# Altium schematic sheet Jetson_Xavier_NX_Carrier_Board_v1.1.SchDoc
size A3
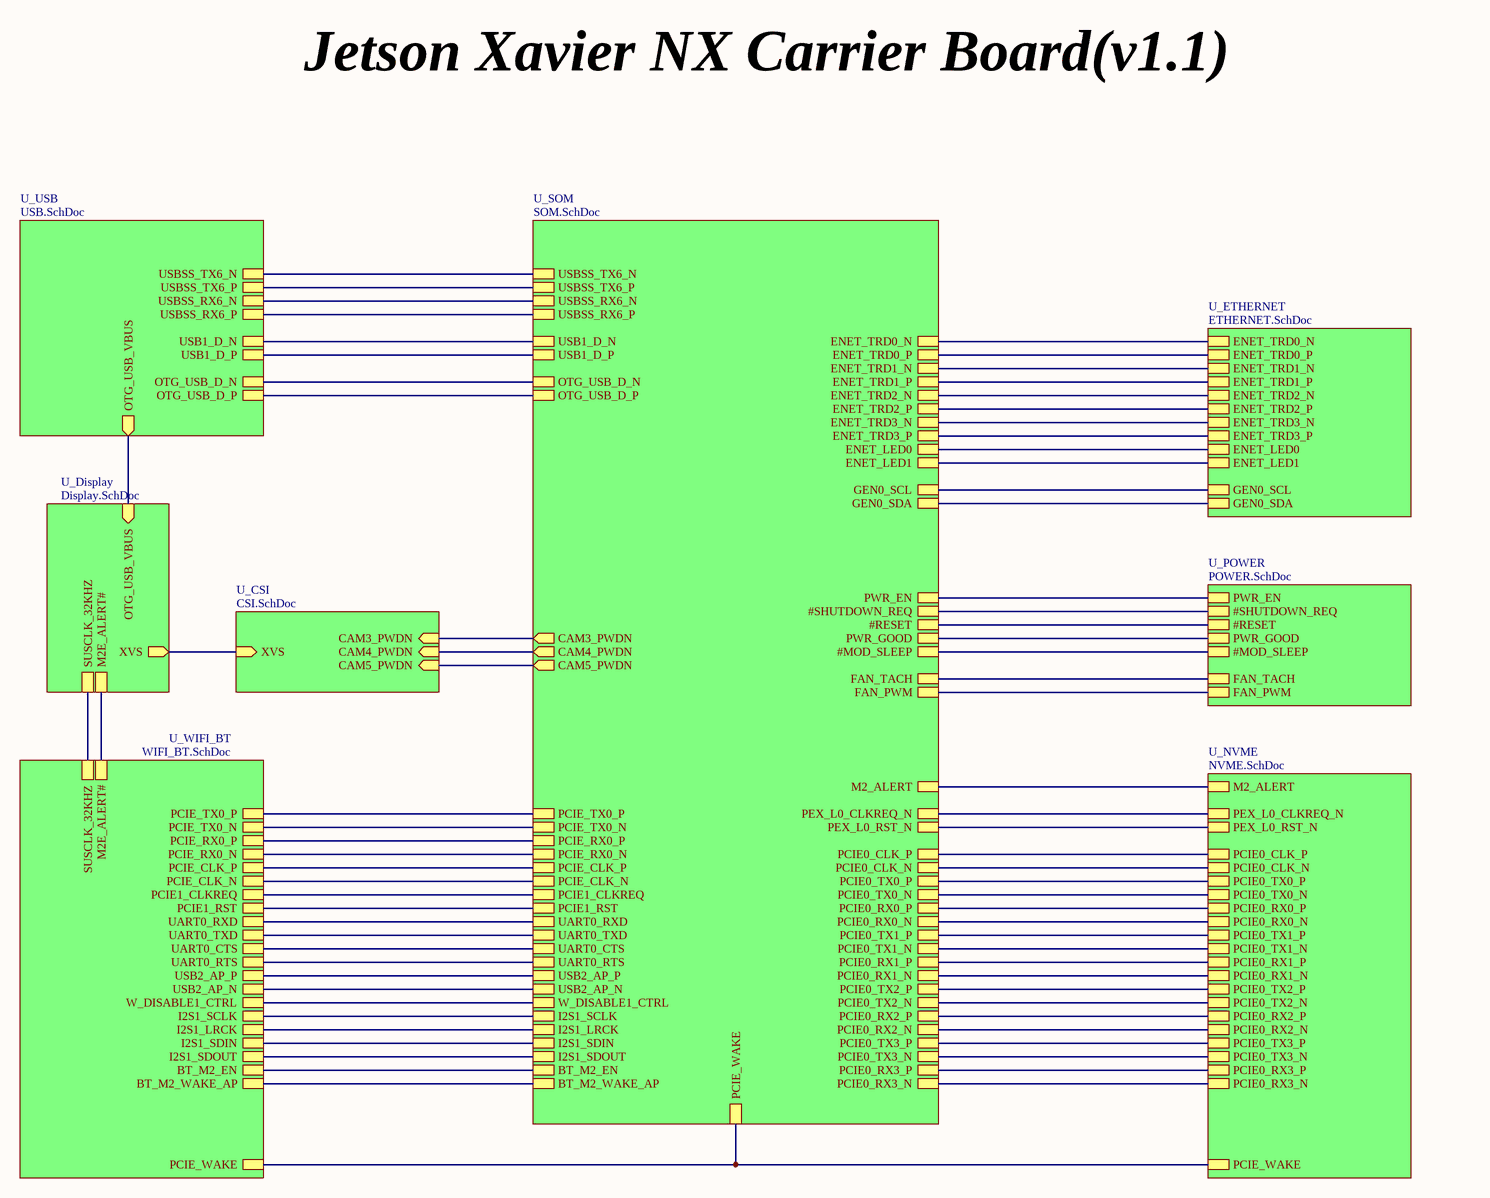
[diagram p0: Jetson_Xavier_NX_Carrier_Board_v1.1.SchDoc]

## Sub-sheets
U_CSI = CSI.SchDoc: XVS (in), CAM3_PWDN (in), CAM4_PWDN (in), CAM5_PWDN (in)
U_Display = Display.SchDoc: OTG_USB_VBUS (in), M2E_ALERT#, SUSCLK_32KHZ, XVS (out)
U_ETHERNET = ETHERNET.SchDoc: ENET_LED1, ENET_TRD0_N, ENET_TRD0_P, ENET_TRD1_N, ENET_TRD1_P, ENET_TRD2_N, ENET_TRD2_P, ENET_TRD3_N, ENET_TRD3_P, ENET_LED0, GEN0_SCL, GEN0_SDA
U_NVME = NVME.SchDoc: PCIE_WAKE, PEX_L0_RST_N, PCIE0_CLK_P, PCIE0_CLK_N, PCIE0_TX0_P, PCIE0_TX0_N, PCIE0_RX0_P, PCIE0_RX0_N, PCIE0_TX1_P, PCIE0_TX1_N, PCIE0_RX1_P, PCIE0_RX1_N, PCIE0_TX2_P, PCIE0_TX2_N, PCIE0_RX2_P, PCIE0_RX2_N, PCIE0_TX3_P, PCIE0_TX3_N, PCIE0_RX3_P, PCIE0_RX3_N, PEX_L0_CLKREQ_N, M2_ALERT
U_POWER = POWER.SchDoc: PWR_EN, #SHUTDOWN_REQ, #RESET, PWR_GOOD, #MOD_SLEEP, FAN_TACH, FAN_PWM
U_SOM = SOM.SchDoc: PWR_EN, #SHUTDOWN_REQ, #RESET, PWR_GOOD, #MOD_SLEEP, GEN0_SCL, GEN0_SDA, PCIE_WAKE, PEX_L0_RST_N, PCIE0_CLK_P, PCIE0_CLK_N, PCIE0_TX0_P, PCIE0_TX0_N, PCIE0_RX0_P, PCIE0_RX0_N, PCIE0_TX1_P, PCIE0_TX1_N, PCIE0_RX1_P, PCIE0_RX1_N, PCIE0_TX2_P, PCIE0_TX2_N, PCIE0_RX2_P, PCIE0_RX2_N, PCIE0_TX3_P, PCIE0_TX3_N, PCIE0_RX3_P, PCIE0_RX3_N, USBSS_TX6_N, USBSS_TX6_P, USBSS_RX6_N, USBSS_RX6_P, ENET_TRD0_N, ENET_TRD0_P, ENET_TRD1_N, ENET_TRD1_P, ENET_TRD2_N, ENET_TRD2_P, ENET_TRD3_N, ENET_TRD3_P, ENET_LED1, ENET_LED0, PEX_L0_CLKREQ_N, M2_ALERT, PCIE1_RST, UART0_RTS, UART0_CTS, UART0_TXD, UART0_RXD, BT_M2_WAKE_AP, BT_M2_EN, W_DISABLE1_CTRL, USB2_AP_N, USB2_AP_P, USB1_D_P, USB1_D_N, OTG_USB_D_P, OTG_USB_D_N, PCIE1_CLKREQ, PCIE_CLK_N, PCIE_CLK_P, PCIE_RX0_N, PCIE_RX0_P, PCIE_TX0_N, PCIE_TX0_P, FAN_PWM, FAN_TACH, I2S1_SCLK, I2S1_LRCK, I2S1_SDIN, I2S1_SDOUT, CAM3_PWDN (out), CAM4_PWDN (out), CAM5_PWDN (out)
U_USB = USB.SchDoc: USBSS_TX6_N, USBSS_TX6_P, USBSS_RX6_N, USBSS_RX6_P, USB1_D_N, USB1_D_P, OTG_USB_VBUS (out), OTG_USB_D_N, OTG_USB_D_P
U_WIFI_BT = WIFI_BT.SchDoc: M2E_ALERT#, W_DISABLE1_CTRL, BT_M2_EN, SUSCLK_32KHZ, UART0_RTS, UART0_CTS, UART0_TXD, UART0_RXD, BT_M2_WAKE_AP, I2S1_SDOUT, I2S1_SDIN, I2S1_LRCK, I2S1_SCLK, USB2_AP_N, USB2_AP_P, PCIE_CLK_N, PCIE_CLK_P, PCIE_RX0_N, PCIE_RX0_P, PCIE_TX0_N, PCIE_TX0_P, PCIE_WAKE, PCIE1_CLKREQ, PCIE1_RST

## Nets
(unnamed): sheet U_Display/OTG_USB_VBUS, sheet U_USB/OTG_USB_VBUS
(unnamed): sheet U_Display/M2E_ALERT#, sheet U_WIFI_BT/M2E_ALERT#
(unnamed): sheet U_Display/SUSCLK_32KHZ, sheet U_WIFI_BT/SUSCLK_32KHZ
(unnamed): sheet U_Display/XVS, sheet U_CSI/XVS
(unnamed): sheet U_ETHERNET/ENET_LED1, sheet U_SOM/ENET_LED1
(unnamed): sheet U_ETHERNET/ENET_TRD0_N, sheet U_SOM/ENET_TRD0_N
(unnamed): sheet U_ETHERNET/ENET_TRD0_P, sheet U_SOM/ENET_TRD0_P
(unnamed): sheet U_ETHERNET/ENET_TRD1_N, sheet U_SOM/ENET_TRD1_N
(unnamed): sheet U_ETHERNET/ENET_TRD1_P, sheet U_SOM/ENET_TRD1_P
(unnamed): sheet U_ETHERNET/ENET_TRD2_N, sheet U_SOM/ENET_TRD2_N
(unnamed): sheet U_ETHERNET/ENET_TRD2_P, sheet U_SOM/ENET_TRD2_P
(unnamed): sheet U_ETHERNET/ENET_TRD3_N, sheet U_SOM/ENET_TRD3_N
(unnamed): sheet U_ETHERNET/ENET_TRD3_P, sheet U_SOM/ENET_TRD3_P
(unnamed): sheet U_ETHERNET/ENET_LED0, sheet U_SOM/ENET_LED0
(unnamed): sheet U_ETHERNET/GEN0_SCL, sheet U_SOM/GEN0_SCL
(unnamed): sheet U_ETHERNET/GEN0_SDA, sheet U_SOM/GEN0_SDA
(unnamed): sheet U_POWER/PWR_EN, sheet U_SOM/PWR_EN
(unnamed): sheet U_POWER/#SHUTDOWN_REQ, sheet U_SOM/#SHUTDOWN_REQ
(unnamed): sheet U_POWER/#RESET, sheet U_SOM/#RESET
(unnamed): sheet U_POWER/PWR_GOOD, sheet U_SOM/PWR_GOOD
(unnamed): sheet U_POWER/#MOD_SLEEP, sheet U_SOM/#MOD_SLEEP
(unnamed): sheet U_POWER/FAN_TACH, sheet U_SOM/FAN_TACH
(unnamed): sheet U_POWER/FAN_PWM, sheet U_SOM/FAN_PWM
(unnamed): sheet U_SOM/PCIE_WAKE, sheet U_WIFI_BT/PCIE_WAKE, sheet U_NVME/PCIE_WAKE
(unnamed): sheet U_SOM/PEX_L0_RST_N, sheet U_NVME/PEX_L0_RST_N
(unnamed): sheet U_SOM/PCIE0_CLK_P, sheet U_NVME/PCIE0_CLK_P
(unnamed): sheet U_SOM/PCIE0_CLK_N, sheet U_NVME/PCIE0_CLK_N
(unnamed): sheet U_SOM/PCIE0_TX0_P, sheet U_NVME/PCIE0_TX0_P
(unnamed): sheet U_SOM/PCIE0_TX0_N, sheet U_NVME/PCIE0_TX0_N
(unnamed): sheet U_SOM/PCIE0_RX0_P, sheet U_NVME/PCIE0_RX0_P
(unnamed): sheet U_SOM/PCIE0_RX0_N, sheet U_NVME/PCIE0_RX0_N
(unnamed): sheet U_SOM/PCIE0_TX1_P, sheet U_NVME/PCIE0_TX1_P
(unnamed): sheet U_SOM/PCIE0_TX1_N, sheet U_NVME/PCIE0_TX1_N
(unnamed): sheet U_SOM/PCIE0_RX1_P, sheet U_NVME/PCIE0_RX1_P
(unnamed): sheet U_SOM/PCIE0_RX1_N, sheet U_NVME/PCIE0_RX1_N
(unnamed): sheet U_SOM/PCIE0_TX2_P, sheet U_NVME/PCIE0_TX2_P
(unnamed): sheet U_SOM/PCIE0_TX2_N, sheet U_NVME/PCIE0_TX2_N
(unnamed): sheet U_SOM/PCIE0_RX2_P, sheet U_NVME/PCIE0_RX2_P
(unnamed): sheet U_SOM/PCIE0_RX2_N, sheet U_NVME/PCIE0_RX2_N
(unnamed): sheet U_SOM/PCIE0_TX3_P, sheet U_NVME/PCIE0_TX3_P
(unnamed): sheet U_SOM/PCIE0_TX3_N, sheet U_NVME/PCIE0_TX3_N
(unnamed): sheet U_SOM/PCIE0_RX3_P, sheet U_NVME/PCIE0_RX3_P
(unnamed): sheet U_SOM/PCIE0_RX3_N, sheet U_NVME/PCIE0_RX3_N
(unnamed): sheet U_SOM/USBSS_TX6_N, sheet U_USB/USBSS_TX6_N
(unnamed): sheet U_SOM/USBSS_TX6_P, sheet U_USB/USBSS_TX6_P
(unnamed): sheet U_SOM/USBSS_RX6_N, sheet U_USB/USBSS_RX6_N
(unnamed): sheet U_SOM/USBSS_RX6_P, sheet U_USB/USBSS_RX6_P
(unnamed): sheet U_SOM/PEX_L0_CLKREQ_N, sheet U_NVME/PEX_L0_CLKREQ_N
(unnamed): sheet U_SOM/M2_ALERT, sheet U_NVME/M2_ALERT
(unnamed): sheet U_SOM/PCIE1_RST, sheet U_WIFI_BT/PCIE1_RST
(unnamed): sheet U_SOM/UART0_RTS, sheet U_WIFI_BT/UART0_RTS
(unnamed): sheet U_SOM/UART0_CTS, sheet U_WIFI_BT/UART0_CTS
(unnamed): sheet U_SOM/UART0_TXD, sheet U_WIFI_BT/UART0_TXD
(unnamed): sheet U_SOM/UART0_RXD, sheet U_WIFI_BT/UART0_RXD
(unnamed): sheet U_SOM/BT_M2_WAKE_AP, sheet U_WIFI_BT/BT_M2_WAKE_AP
(unnamed): sheet U_SOM/BT_M2_EN, sheet U_WIFI_BT/BT_M2_EN
(unnamed): sheet U_SOM/W_DISABLE1_CTRL, sheet U_WIFI_BT/W_DISABLE1_CTRL
(unnamed): sheet U_SOM/USB2_AP_N, sheet U_WIFI_BT/USB2_AP_N
(unnamed): sheet U_SOM/USB2_AP_P, sheet U_WIFI_BT/USB2_AP_P
(unnamed): sheet U_SOM/USB1_D_P, sheet U_USB/USB1_D_P
(unnamed): sheet U_SOM/USB1_D_N, sheet U_USB/USB1_D_N
(unnamed): sheet U_SOM/OTG_USB_D_P, sheet U_USB/OTG_USB_D_P
(unnamed): sheet U_SOM/OTG_USB_D_N, sheet U_USB/OTG_USB_D_N
(unnamed): sheet U_SOM/PCIE1_CLKREQ, sheet U_WIFI_BT/PCIE1_CLKREQ
(unnamed): sheet U_SOM/PCIE_CLK_N, sheet U_WIFI_BT/PCIE_CLK_N
(unnamed): sheet U_SOM/PCIE_CLK_P, sheet U_WIFI_BT/PCIE_CLK_P
(unnamed): sheet U_SOM/PCIE_RX0_N, sheet U_WIFI_BT/PCIE_RX0_N
(unnamed): sheet U_SOM/PCIE_RX0_P, sheet U_WIFI_BT/PCIE_RX0_P
(unnamed): sheet U_SOM/PCIE_TX0_N, sheet U_WIFI_BT/PCIE_TX0_N
(unnamed): sheet U_SOM/PCIE_TX0_P, sheet U_WIFI_BT/PCIE_TX0_P
(unnamed): sheet U_SOM/I2S1_SCLK, sheet U_WIFI_BT/I2S1_SCLK
(unnamed): sheet U_SOM/I2S1_LRCK, sheet U_WIFI_BT/I2S1_LRCK
(unnamed): sheet U_SOM/I2S1_SDIN, sheet U_WIFI_BT/I2S1_SDIN
(unnamed): sheet U_SOM/I2S1_SDOUT, sheet U_WIFI_BT/I2S1_SDOUT
(unnamed): sheet U_SOM/CAM3_PWDN, sheet U_CSI/CAM3_PWDN
(unnamed): sheet U_SOM/CAM4_PWDN, sheet U_CSI/CAM4_PWDN
(unnamed): sheet U_SOM/CAM5_PWDN, sheet U_CSI/CAM5_PWDN

## Notes on the sheet
- Jetson Xavier NX Carrier Board(v1.1)
- Title
- Size:
- Date:
- A3
- Number:
- Time:
- Revision:
- Sheet
- of
- Go360.io